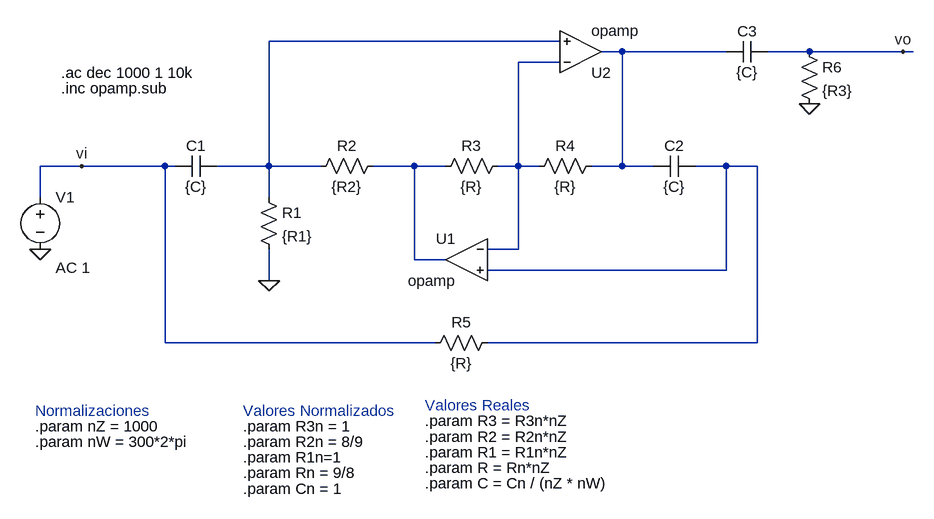
[diagram p0: schematic implementacion1.asc]
implementacion1.asc, the LTspice schematic file:
Version 4
SHEET 1 1328 928
WIRE 768 -80 320 -80
WIRE 864 -64 832 -64
WIRE 1024 -64 864 -64
WIRE 1152 -64 1088 -64
WIRE 1296 -64 1152 -64
WIRE 1312 -64 1296 -64
WIRE 768 -48 704 -48
WIRE 32 112 -32 112
WIRE 160 112 32 112
WIRE 176 112 160 112
WIRE 320 112 320 -80
WIRE 320 112 240 112
WIRE 400 112 320 112
WIRE 544 112 480 112
WIRE 592 112 544 112
WIRE 704 112 704 -48
WIRE 704 112 672 112
WIRE 736 112 704 112
WIRE 864 112 864 -64
WIRE 864 112 816 112
WIRE 912 112 864 112
WIRE 1024 112 976 112
WIRE 1072 112 1024 112
WIRE -32 160 -32 112
WIRE 320 160 320 112
WIRE 704 240 704 112
WIRE 704 240 656 240
WIRE 544 256 544 112
WIRE 592 256 544 256
WIRE 1024 272 1024 112
WIRE 1024 272 656 272
WIRE 320 288 320 240
WIRE 160 384 160 112
WIRE 576 384 160 384
WIRE 1072 384 1072 112
WIRE 1072 384 656 384
FLAG 320 288 0
FLAG 32 112 vi
FLAG 1152 16 0
FLAG 1296 -64 vo
FLAG -32 240 0
SYMBOL cap 240 96 R90
WINDOW 0 0 32 VBottom 2
WINDOW 3 32 32 VTop 2
SYMATTR InstName C1
SYMATTR Value {C}
SYMBOL res 304 144 R0
SYMATTR InstName R1
SYMATTR Value {R1}
SYMBOL res 496 96 R90
WINDOW 0 0 56 VBottom 2
WINDOW 3 32 56 VTop 2
SYMATTR InstName R2
SYMATTR Value {R2}
SYMBOL res 688 96 R90
WINDOW 0 0 56 VBottom 2
WINDOW 3 32 56 VTop 2
SYMATTR InstName R3
SYMATTR Value {R}
SYMBOL res 832 96 R90
WINDOW 0 0 56 VBottom 2
WINDOW 3 32 56 VTop 2
SYMATTR InstName R4
SYMATTR Value {R}
SYMBOL cap 976 96 R90
WINDOW 0 0 32 VBottom 2
WINDOW 3 32 32 VTop 2
SYMATTR InstName C2
SYMATTR Value {C}
SYMBOL res 672 368 R90
WINDOW 0 0 56 VBottom 2
WINDOW 3 32 56 VTop 2
SYMATTR InstName R5
SYMATTR Value {R}
SYMBOL OpAmps\\opamp 624 192 M0
SYMATTR InstName U1
SYMBOL OpAmps\\opamp 800 0 M180
SYMATTR InstName U2
SYMBOL cap 1088 -80 R90
WINDOW 0 0 32 VBottom 2
WINDOW 3 32 32 VTop 2
SYMATTR InstName C3
SYMATTR Value {C}
SYMBOL res 1136 -80 R0
SYMATTR InstName R6
SYMATTR Value {R3}
SYMBOL voltage -32 144 R0
WINDOW 123 24 124 Left 2
WINDOW 39 0 0 Left 0
SYMATTR Value2 AC 1
SYMATTR InstName V1
SYMATTR Value ""
TEXT 280 512 Left 2 !.param R3n = 1
TEXT 280 536 Left 2 !.param R2n = 8/9
TEXT 280 560 Left 2 !.param R1n=1
TEXT 280 608 Left 2 !.param Cn = 1
TEXT 560 504 Left 2 !.param R3 = R3n*nZ
TEXT 560 528 Left 2 !.param R2 = R2n*nZ
TEXT 560 576 Left 2 !.param R = Rn*nZ
TEXT 560 600 Left 2 !.param C = Cn / (nZ * nW)
TEXT -40 512 Left 2 !.param nZ = 1000
TEXT -40 536 Left 2 !.param nW = 300*2*pi
TEXT -40 488 Left 2 ;Normalizaciones
TEXT 280 488 Left 2 ;Valores Normalizados
TEXT 560 480 Left 2 ;Valores Reales
TEXT 0 -32 Left 2 !.ac dec 1000 1 10k
TEXT 0 -8 Left 2 !.inc opamp.sub
TEXT 280 584 Left 2 !.param Rn = 9/8
TEXT 560 552 Left 2 !.param R1 = R1n*nZ

The netlist it stands for:
* implementacion1.asc
C1 N001 vi {C}
R1 N001 0 {R1}
R2 N004 N001 {R2}
R3 N003 N004 {R}
R4 N002 N003 {R}
C2 N005 N002 {C}
R5 N005 vi {R}
XU1 N003 N005 N004 opamp Aol=100K GBW=10Meg  ; pins invin noninvin out
XU2 N003 N001 N002 opamp Aol=100K GBW=10Meg  ; pins invin noninvin out
C3 vo N002 {C}
R6 vo 0 {R3}
V1 vi 0 AC 1
.param R3n = 1
.param R2n = 8/9
.param R1n=1
.param Cn = 1
.param R3 = R3n*nZ
.param R2 = R2n*nZ
.param R = Rn*nZ
.param C = Cn / (nZ * nW)
.param nZ = 1000
.param nW = 300*2*pi
* Normalizaciones
* Valores Normalizados
* Valores Reales
.ac dec 1000 1 10k
.inc opamp.sub
.param Rn = 9/8
.param R1 = R1n*nZ
.backanno
.end